# EasyEDA schematic SCH_Complete_System.json
TITLE: Cube circuit; REV: 1.0; Date: 2022-02-20; Sheet: 1/1; Drawn By: Nasmin Uddin; Company: Your Company
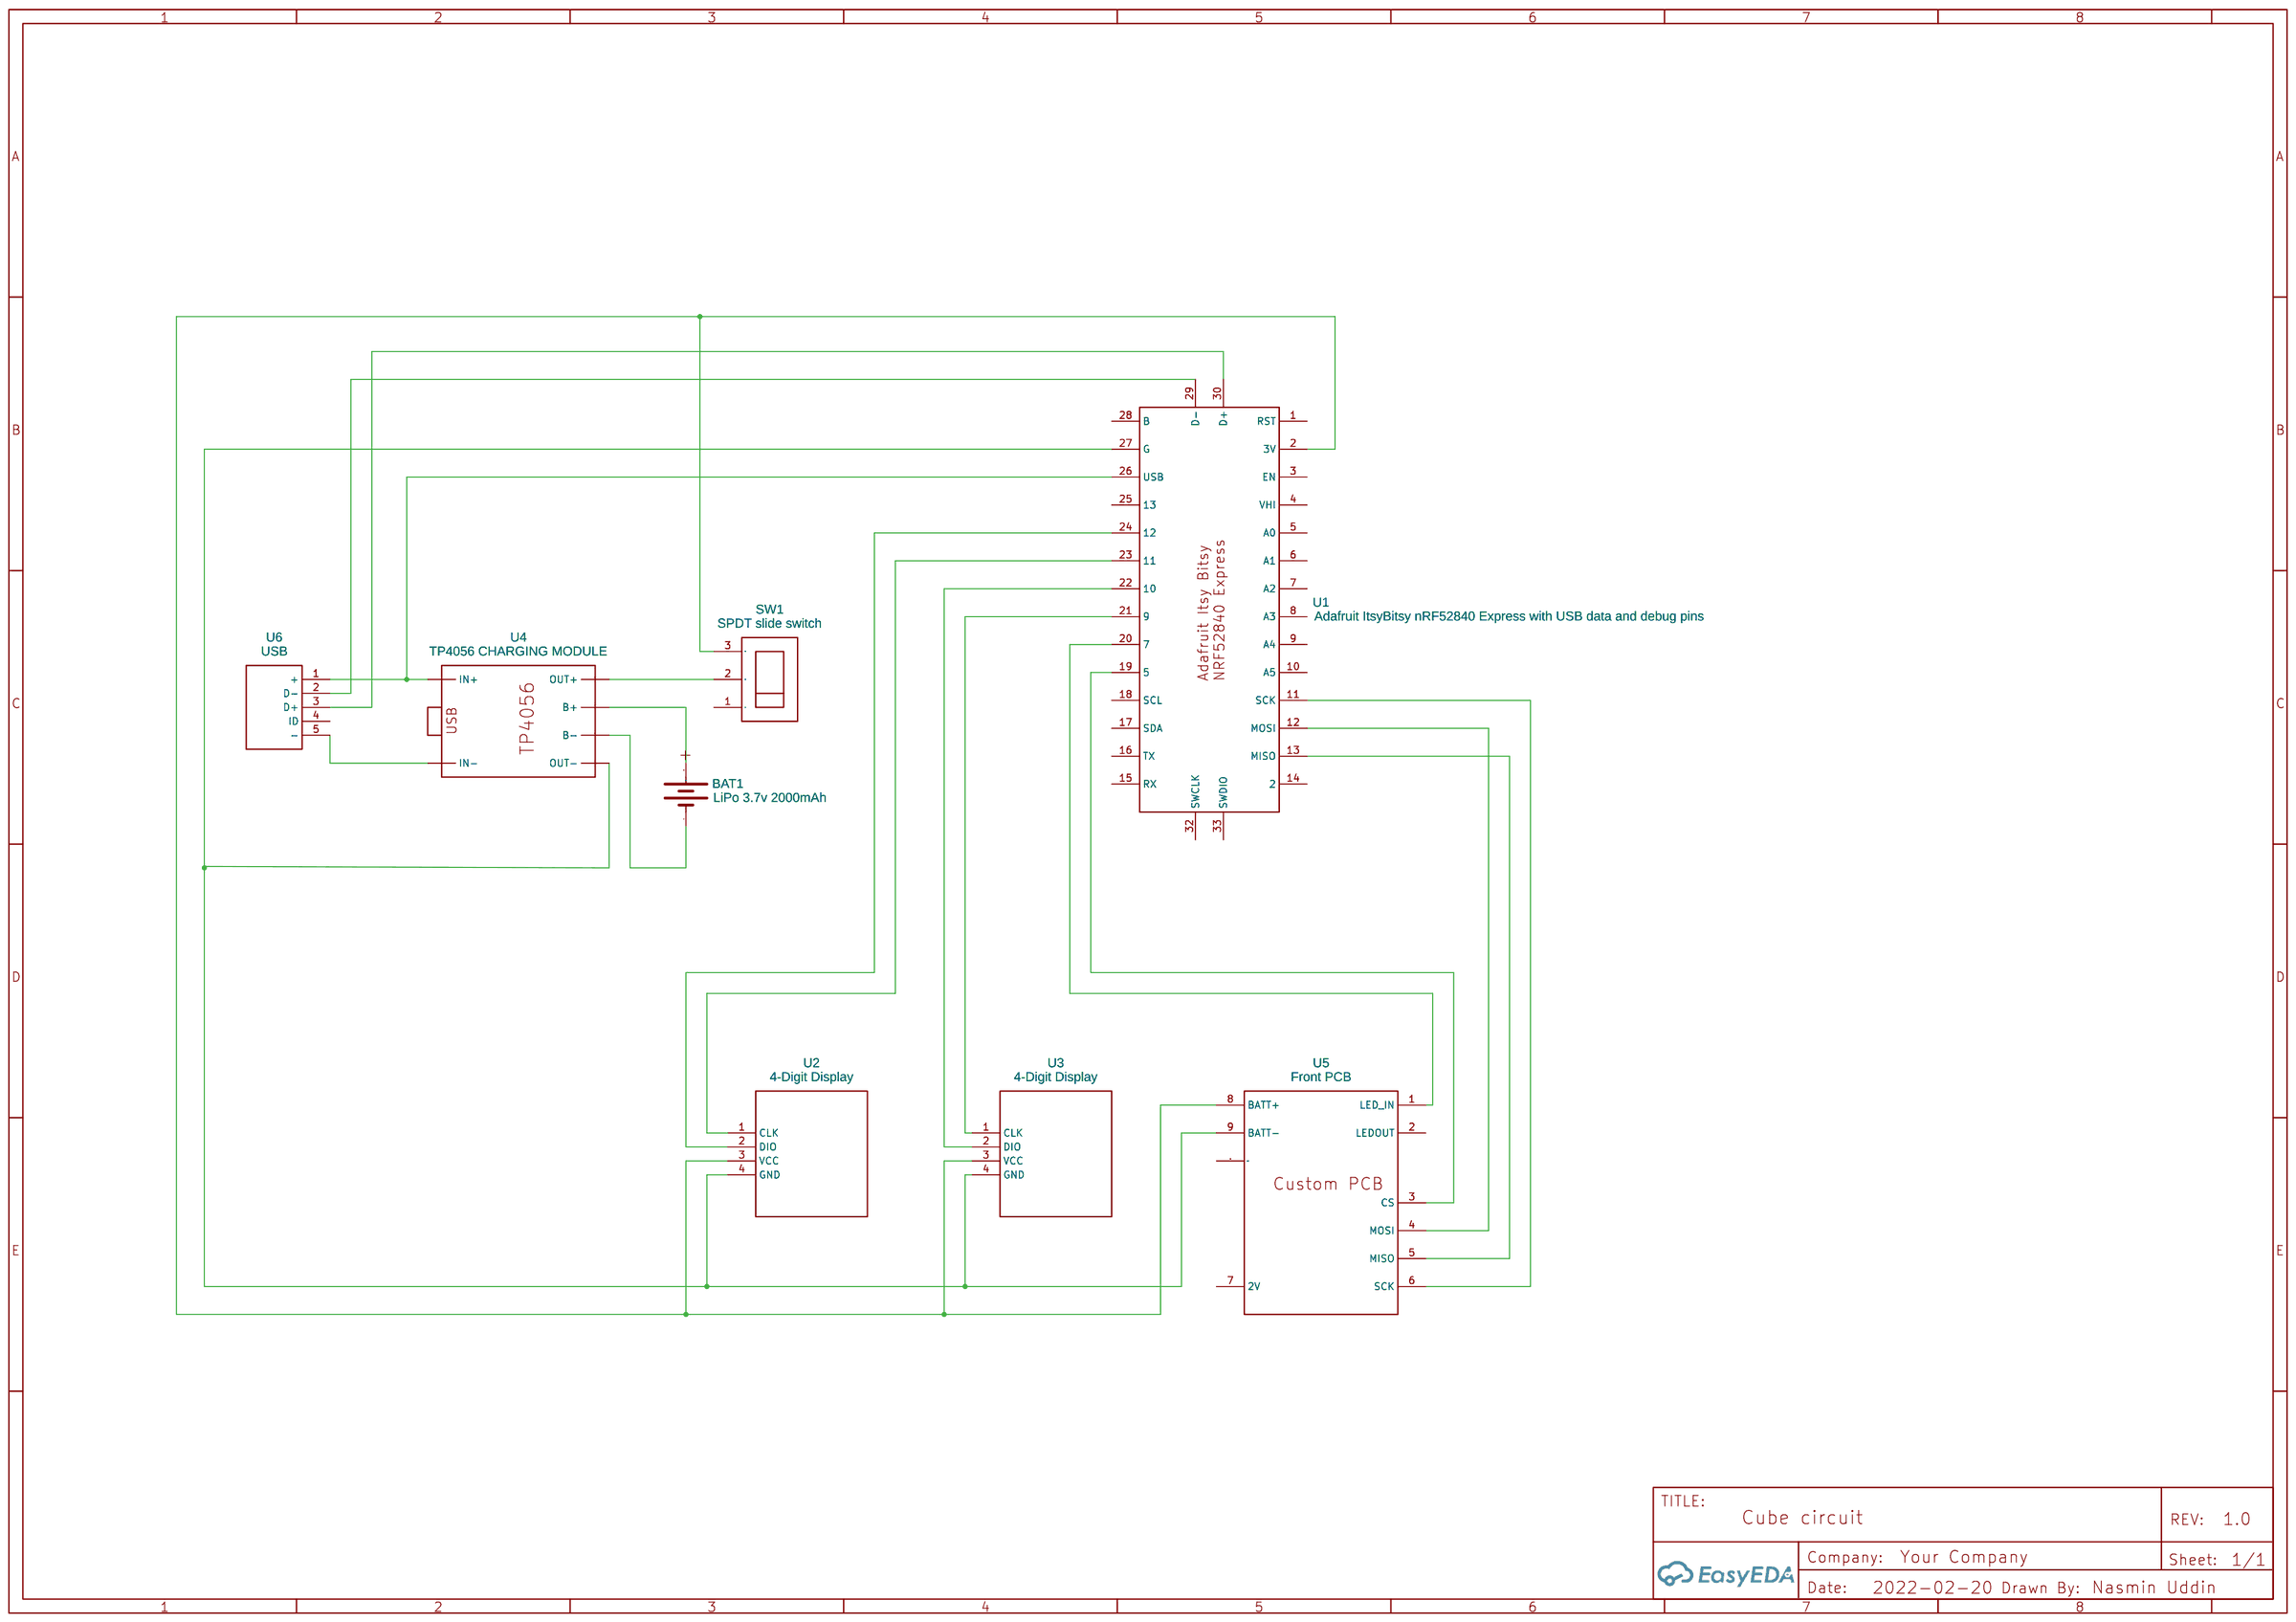
[diagram p0: schematic sheet]

## Parts
BAT1  LiPo 3.7v 2000mAh
SW1  SPDT slide switch  [SPDT PANEL MOUNT VERTICAL]
U1  Adafruit ItsyBitsy nRF52840 Express with USB data and debug pins
U2  4-Digit Display  [GROVE - 4-DIGIT DISPLAY]
U3  4-Digit Display  [GROVE - 4-DIGIT DISPLAY]
U4  TP4056 CHARGING MODULE  [TP4056+18650 MY]
U5  Front PCB
U6  USB  [MICRO USB]

## Library data of the parts
BAT1 = LiPo 3.7v 5000mAh: Battery Holders; Contributor: gurugap1
SW1 = SPDT VERTICAL SLIDE SWITCH COPY: Manufacturer: DIYhz; Manufacturer Part: BDZ3P12D10-20; Supplier: Amazon; Supplier Part: BDZ3P12D10-20; link: www.amazon.com; Contributor: pgillispie
U1 = Adafruit ItsyBitsy nRF52840 Express with USB data and debug pins: Contributor: Kyuuketsu92
U2 U3 = Grove - 4-Digit Display: sourceId: VNHBvN5nT; Supplier Part: undefined; Supplier: SeeedStudio
U4 = TP4056 CHARGING MODULE: Manufacturer Part: TP4056; Contributor: FrankenApps; link: https://www.banggood.com/20X-TP4056-5V-1A-Lipo-Battery-Mini-USB-Charging-Board-Charger-Module-p-1095077.html?rmmds=search
U5 = Custom PCB symbol: Contributor: Kyuuketsu92
U6 = USB: Contributor: xdc_2017

## Nets
Net-(BAT1-+): BAT1.+ U4.5(B+)
Net-(BAT1--): BAT1.- U4.6(B-)
Net-(SW1-2): SW1.2 U4.3(OUT+)
Net-(SW1-3): SW1.3 U1.2(3V) U2.3(VCC) U3.3(VCC) U5.8(BATT+)
Net-(U1-11): U1.11(SCK) U5.6(SCK)
Net-(U1-12): U1.12(MOSI) U5.4(MOSI)
Net-(U1-13): U1.13(MISO) U5.5(MISO)
Net-(U1-19): U1.19(5) U5.3(CS)
Net-(U1-20): U1.20(7) U5.1(LED IN)
Net-(U1-21): U1.21(9) U3.1(CLK)
Net-(U1-22): U1.22(10) U3.2(DIO)
Net-(U1-23): U1.23(11) U2.1(CLK)
Net-(U1-24): U1.24(12) U2.2(DIO)
Net-(U1-26): U1.26(USB) U4.1(IN+) U6.1(+)
Net-(U1-27): U1.27(G) U2.4(GND) U3.4(GND) U4.4(OUT-) U5.9(BATT-)
Net-(U1-29): U1.29(D-) U6.2(D-)
Net-(U1-30): U1.30(D+) U6.3(D+)
Net-(U4-2): U4.2(IN-) U6.5(-)

Not connected (* = marked no-connect by the designer): SW1 1; U1 1(RST) 3(EN) 4(VHI) 5(A0) 6(A1) 7(A2) 8(A3) 9(A4) 10(A5) 14(2) 15(RX) 16(TX) 17(SDA) 18(SCL) 25(13) 28(B) 32(SWCLK) 33(SWDIO); U5 2(LEDOUT) 7(2V) 10(DGND); U6 4(ID)
